# EAGLE board esp-n64 (EAGLE 9.6.2)
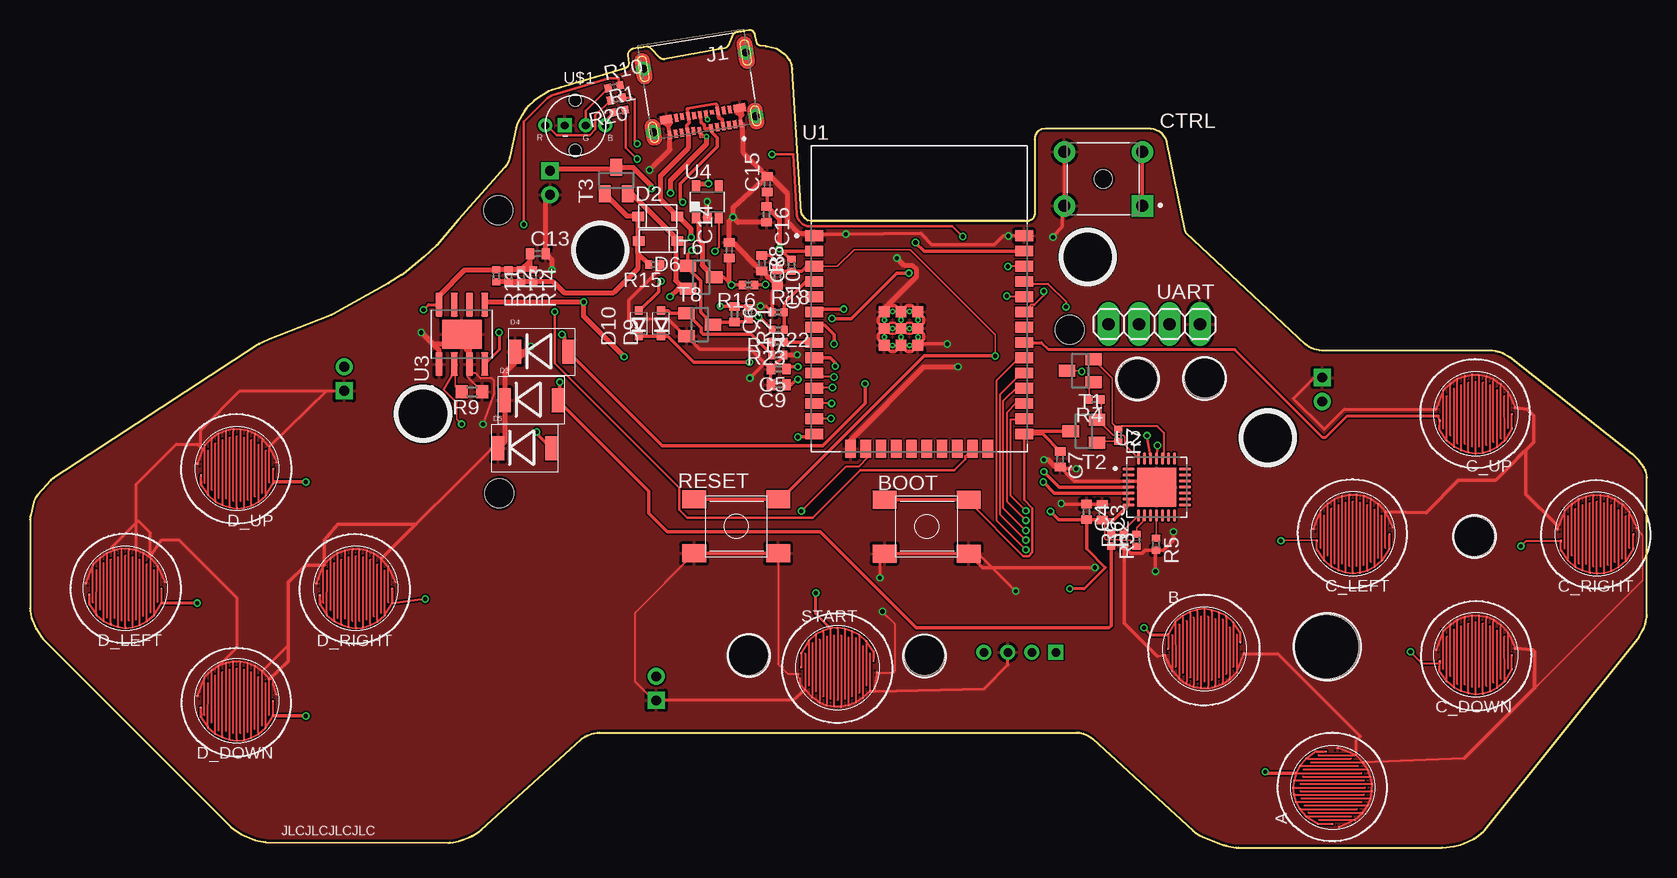
[diagram p2: board, top side]
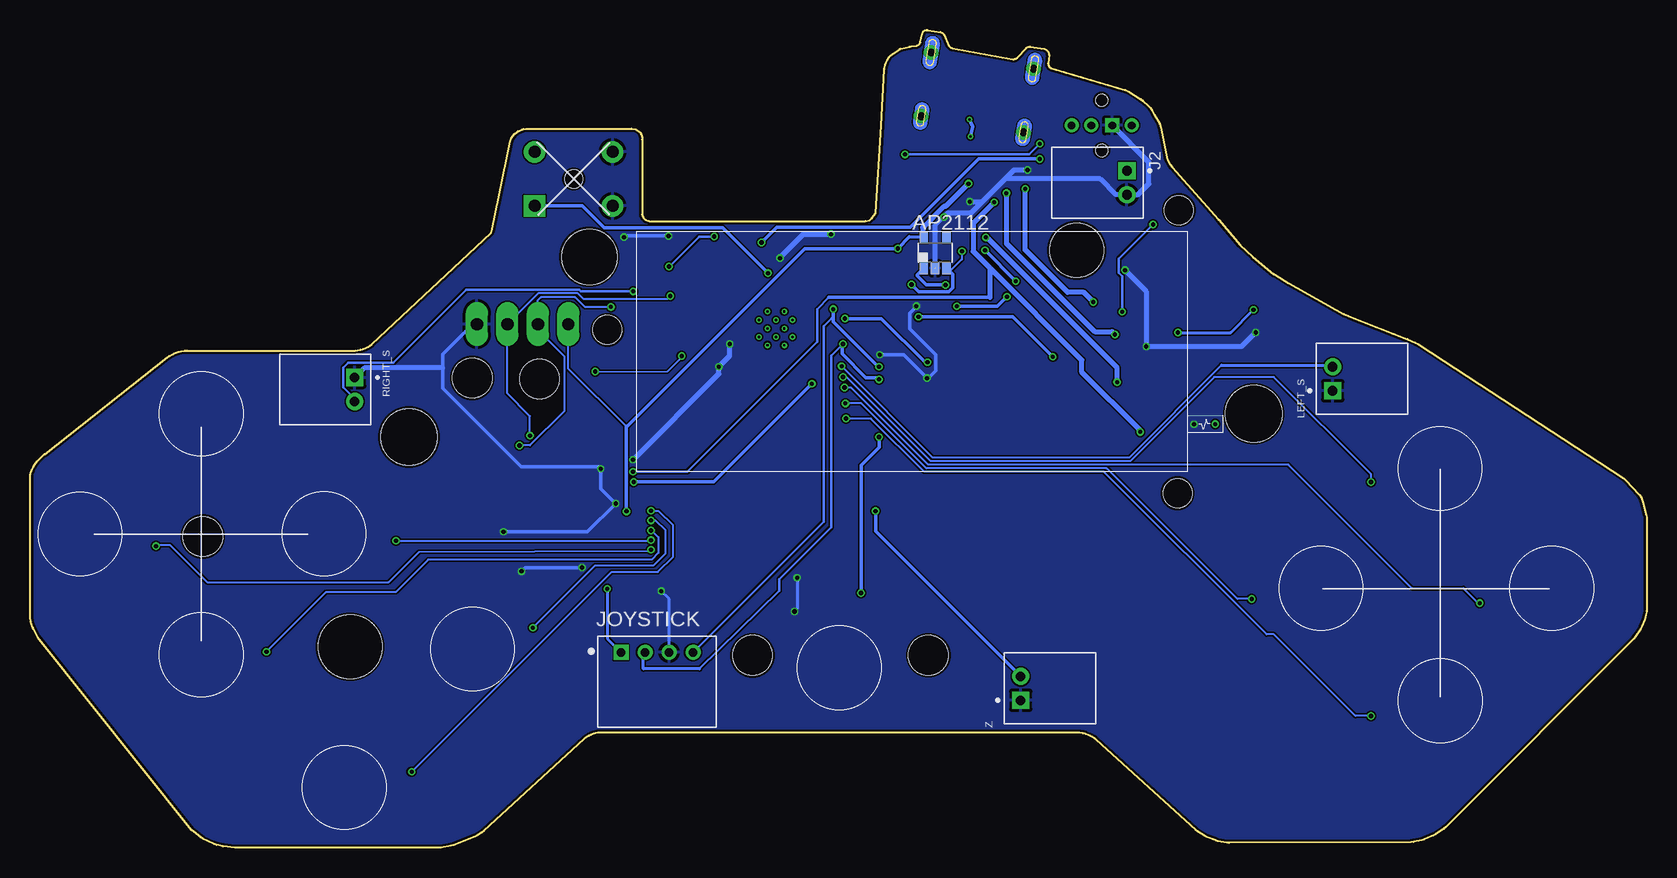
[diagram p3: board, bottom side, seen from below]

Size 134.75 x 68.14 mm. Coordinates in mm from the lower left corner, seen from the top.
Outline: 41.04,61.08 40.61,60.32 40.51,60.03 40,57.54 39.96,57.4 39.88,57.19 39.74,56.93 39.57,56.71 35.7,52.33 33.88,50.21 32.86,49.25 31.09,47.81 30.99,47.74 29.87,47.03 25.25,44.47 25.11,44.4 24.87,44.29 19.96,42.39 19.33,42.1 19.12,41.98 18.99,41.92 1.94,30.78 1.75,30.62 0.64,29.41 0.49,29.2 0.42,29.07 0.33,28.84 0.05,27.71 0.02,27.56 0,27.37 0,19.92 0.02,19.72 0.12,19.19 0.18,19 0.42,18.42 0.52,18.24 0.96,17.58 1.08,17.43 16.77,1.69 16.92,1.57 17.6,1.11 17.77,1.02 18.56,0.69 18.75,0.63 19.45,0.49 19.65,0.47 34.83,0.41 35.02,0.42 35.75,0.56 35.93,0.61 36.64,0.88 36.81,0.96 37.47,1.37 37.62,1.48 45.88,8.99 46.03,9.11 46.26,9.25 46.43,9.33 46.81,9.48 46.98,9.53 47.28,9.58 47.46,9.6 87.24,9.6 87.42,9.58 87.6,9.55 87.78,9.5 88.01,9.41 88.18,9.33 88.42,9.18 88.57,9.06 96.92,1.4 97.07,1.29 97.51,1.01 97.68,0.93 99.48,0.23 99.66,0.18 100.5,0.02 100.69,0 117.67,0 118.66,0.11 119.21,0.24 119.42,0.31 120.35,0.75 120.54,0.87 121.09,1.31 121.25,1.47 133.99,17.39 134.08,17.53 134.45,18.19 134.52,18.34 134.62,18.65 134.66,18.81 134.73,19.21 134.75,19.38 134.75,30.87 134.72,31.09 134.68,31.25 134.61,31.47 134.49,31.72 134.36,31.91 134.12,32.21 134.05,32.3 133.61,32.73 133.53,32.8 123.29,40.87 123.15,40.96 122.87,41.12 122.72,41.19 122.33,41.32 122.17,41.36 121.82,41.42 121.66,41.43 107.63,41.43 107.45,41.45 107.19,41.5 107.01,41.55 106.74,41.66 106.57,41.75 106.43,41.84 106.28,41.95 96.35,51.23 96.27,51.36 94.74,58.86 94.63,59.13 94.36,59.48 94.18,59.63 94.06,59.71 93.75,59.85 93.64,59.88 93.4,59.91 84.61,59.93 84.26,59.86 84,59.7 83.88,59.59 83.81,59.44 83.73,59.21 83.73,59.01 83.73,52.77 83.71,52.67 83.66,52.56 83.61,52.48 83.48,52.35 83.39,52.29 83.24,52.23 83.15,52.21 65.13,52.21 64.78,52.29 64.59,52.46 64.38,52.71 64.3,52.83 64.28,52.91 63.83,60.16 63.54,64.88 63.48,65.24 63.43,65.39 63.31,65.63 63.12,65.9 63,66.02 62.87,66.13 62.28,66.55 62.19,66.59 61.45,66.77 61.33,66.79 60.84,66.84 60.7,66.91 60.6,66.99 60.56,67.11 60.4,67.82 60.37,67.91 60.29,68.03 60.21,68.08 60.12,68.12 60.03,68.14 59.93,68.14 58.85,67.96 58.74,67.91 58.65,67.84 58.57,67.74 58.19,66.85 58.11,66.75 58.02,66.68 57.91,66.63 52.83,65.7 52.71,65.71 52.6,65.75 52.49,65.82 51.73,66.64 51.65,66.69 51.55,66.75 51.39,66.77 50.21,66.56 50.12,66.53 50.05,66.49 49.98,66.43 49.91,66.34 49.86,66.25 49.83,66.16 49.82,66.06 49.91,65.36 49.87,65.19 49.8,65.07 49.66,64.96 43.45,63.13 43.21,63.02 42.18,62.38 42.02,62.26 41.52,61.8 41.41,61.68 41.31,61.55 41.22,61.42 41.04,61.08
Copper layers (1*16): Top 0.035mm / dielectric 1.6mm / Bottom 0.035mm
Design rules "jlcpcb-2layers-edited": minimum track width 5mil, minimum drill 0.2mm, track to track 5mil, track to pad 5mil, pad to pad 5mil, via to via 5mil, smd to smd 5mil, copper to edge 0.2mm, drill to drill 6mil, minimum pad ring 0.13mm, minimum via ring 0.13mm, stop-mask expansion 4mil, vias tented up to drill 0mil, thermal gap 10mil
Holes 4.7 mm at 32.76,36.16 103.17,34.23
Holes 4.5 mm at 47.51,49.78
Holes 4.6 mm at 88.13,49.24
Holes 3.3 mm at 92.3,39.07 97.89,39.15 120.35,25.94 74.54,16.03 59.88,16.04
Holes 5.3 mm at 108.07,16.75
Holes 1.5 mm at 89.44,55.73
Holes 2.4 mm at 39.01,53.13 39.12,29.54 86.63,43.15
vRestrict: area 2.9,7.1 to 32.3,36.5; area 38.2,31.4 to 84.2,51.4; 1 lines

## Footprints (pad centres in the part's own frame; a part is rotated, then mirrored left to right if it is on the bottom)
BUTTON-PAD = smd 0.15 x 0.15: DATA 3,0.56; DATA2 2.41,2.22; DATA3 1.8,2.75; DATA4 1.2,3.05; DATA5 0.6,3.23; DATA6 0,3.33; DATA7 -0.6,3.27; DATA8 -1.2,3.09; DATA9 -1.8,2.77; DATA10 -2.41,2.25; DATA11 -3.03,1.23; DATA12 -3.03,0.01; G2 2.7,-1.95; G3 2.1,-2.51; G4 1.52,-2.91; G5 0.9,-3.14; G6 0.3,-3.27; G7 -0.3,-3.25; G8 -0.91,-3.15; G9 -1.5,-2.9; G10 -2.11,-2.48; G11 -2.7,-1.82; G12 -3.3,-0.52; GND 3.3,-0.4
SOT-23-5 = smd 0.69 x 0.99: 1 -0.95,-1.29; 2 0,-1.29; 3 0.95,-1.29; 4 0.95,1.3; 5 -0.95,1.3
TS1187 = smd 2 x 1.5: A -3.5,2.25; B 3.5,2.25; C -3.5,-2.25; D 3.5,-2.25
C0402 = smd 0.7 x 0.9: 1 -0.65,0; 2 0.65,0
SW_FSM14J = drill 1 square: 1 -3.25,2.25 | drill 1: 2 -3.25,-2.25; 3 3.25,2.25; 4 3.25,-2.25
SOD-123 = smd 1 x 0.8: A 1.62,0; C -1.62,0
P6SMB6 = smd 1 x 2: 1 -2.21,0; 2 2.21,0
SOD323 = smd 0.7 x 0.7: A 1.075,0; C -1.075,0
MOLEX_105450-0101-SIMPLE = smd 0.3 x 0.7: A1 -3,3.77; A2 -2.5,3.77; A3 -2,3.77; A4 -1.5,3.77; A5 -1,3.77; A6 -0.5,3.77; A8 1,3.77; A9 1.5,3.77; A10 2,3.77; A11 2.5,3.77; A12 3,3.77; B2 2.25,2.47; B4 1.25,2.47; B9 -1.25,2.47; B10 -1.75,2.47; B11 -2.25,2.47 | smd 0.3 x 0.6: A7 0.5,3.82; B3 1.75,2.42; B5 0.75,2.52; B6 0.25,2.52; B7 -0.25,2.52 | smd 1 x 0.7: B1 3.1,2.47; B12 -3.1,2.47 | smd 0.3 x 0.4: B8 -0.75,2.47 | drill 0.2 pad 0.4: P$1 0,4.4; P$2 -0.3,3 | drill 0.65 pad 1.2: S1 -4.32,3.36; S2 4.32,3.36; S3 -4.32,-2; S4 4.32,-2
JST_S2B-PH-K-S(LF)(SN) = drill 0.8 square: 1 -1,0 | drill 0.8: 2 1,0
JST_S4B-PH-K-S(LF)(SN) = drill 0.7 square: 1 -3,0 | drill 0.7: 2 -1,0; 3 1,0; 4 3,0
R0402 = smd 0.6 x 0.7: 1 -0.5,0; 2 0.5,0
R0603 = smd 1 x 1.1: 1 -0.85,0; 2 0.85,0
SOT23 = smd 1.4 x 1: 1 -1.1,0.95; 2 -1.1,-0.95; 3 1.1,0
ESP32-WROOM-32E = smd 1.5 x 0.9: 1 -8.75,5.26; 2 -8.75,3.99; 3 -8.75,2.72; 4 -8.75,1.45; 5 -8.75,0.18; 6 -8.75,-1.09; 7 -8.75,-2.36; 8 -8.75,-3.63; 9 -8.75,-4.9; 10 -8.75,-6.17; 11 -8.75,-7.44; 12 -8.75,-8.71; 13 -8.75,-9.98; 14 -8.75,-11.25; 25 8.75,-11.25; 26 8.75,-9.98; 27 8.75,-8.71; 28 8.75,-7.44; 29 8.75,-6.17; 30 8.75,-4.9; 31 8.75,-3.63; 32 8.75,-2.36; 33 8.75,-1.09; 34 8.75,0.18; 35 8.75,1.45; 36 8.75,2.72; 37 8.75,3.99; 38 8.75,5.26 | smd 0.9 x 1.5: 15 -5.715,-12.5; 16 -4.445,-12.5; 17 -3.175,-12.5; 18 -1.905,-12.5; 19 -0.635,-12.5; 20 0.635,-12.5; 21 1.905,-12.5; 22 3.175,-12.5; 23 4.445,-12.5; 24 5.715,-12.5 | smd 0.9 x 0.9: 39_1 -2.9,-1.06; 39_2 -1.5,-1.06; 39_3 -0.1,-1.06; 39_4 -2.9,-2.46; 39_5 -1.5,-2.46; 39_6 -0.1,-2.46; 39_7 -2.9,-3.86; 39_8 -1.5,-3.86; 39_9 -0.1,-3.86 | drill 0.2 pad 0.3: 39_10 -2.2,-1.06; 39_11 -0.8,-1.06; 39_12 -2.9,-1.76; 39_13 -1.5,-1.76; 39_14 -0.1,-1.76; 39_15 -2.2,-2.46; 39_16 -0.8,-2.46; 39_17 -2.9,-3.16; 39_18 -1.5,-3.16; 39_19 -0.1,-3.16; 39_20 -2.2,-3.86; 39_21 -0.8,-3.86
QFN50P500X500X80-29N = smd 1.01 x 0.27: 1 -2.36,1.5; 2 -2.36,1; 3 -2.36,0.5; 4 -2.36,0; 5 -2.36,-0.5; 6 -2.36,-1; 7 -2.36,-1.5; 15 2.36,-1.5; 16 2.36,-1; 17 2.36,-0.5; 18 2.36,0; 19 2.36,0.5; 20 2.36,1; 21 2.36,1.5 | smd 0.27 x 1.01: 8 -1.5,-2.36; 9 -1,-2.36; 10 -0.5,-2.36; 11 0,-2.36; 12 0.5,-2.36; 13 1,-2.36; 14 1.5,-2.36; 22 1.5,2.36; 23 1,2.36; 24 0.5,2.36; 25 0,2.36; 26 -0.5,2.36; 27 -1,2.36; 28 -1.5,2.36 | smd 3.25 x 3.25: 29 0,0
SOP127P600X175-9N = smd 1.97 x 0.6: 1 -2.475,1.905; 2 -2.475,0.635; 3 -2.475,-0.635; 4 -2.475,-1.905; 5 2.475,-1.905; 6 2.475,-0.635; 7 2.475,0.635; 8 2.475,1.905 | smd 2.413 x 3.302: 9 0,0
1X04-LED-RGB = drill 0.65 square: GND -0.87,-0.01 | drill 0.65: VB 2.51,-0.01; VG 0.87,-0.01; VR -2.51,-0.01 | hole 1: 0,2.1; 0,-2.1
1X04 = drill 1.016 long: 1 -3.81,0; 2 -1.27,0; 3 1.27,0; 4 3.81,0

## Placement (x,y rotation side)
A  BUTTONPCB-CONDUCTIVE  [BUTTON-PAD]  108.57,5.02 90 top
AP2112  AP2112K  [SOT-23-5]  59.32,49.59 0 bottom
B  BUTTONPCB-CONDUCTIVE  [BUTTON-PAD]  97.87,16.57 0 top
BOOT  TS1187-SIMPLE  [TS1187]  74.72,26.77 180 top
C3  C_4.7UF/10V_0402  [C0402]  89.36,27.98 270 top
C4  C_100NF/16V_0402  [C0402]  88.05,27.99 270 top
C5  C_100NF/16V_0402  [C0402]  62.39,39.89 180 top
C6  10NF/50V  [C0402]  58.71,44.45 270 top
C7  C_100NF/16V_0402  [C0402]  85.85,32.37 270 top
C8  C_100NF/16V_0402  [C0402]  60.99,48.7 270 top
C9  C_100NF/16V_0402  [C0402]  62.39,38.57 180 top
C10  C_100NF/16V_0402  [C0402]  62.29,47.51 270 top
C13  C_1UF/25V_0402  [C0402]  42.33,49.51 0 top
C14  C_10UF/6.3V_0402  [C0402]  58.27,49.79 90 top
C15  C_10UF/6.3V_0402  [C0402]  61.44,55.29 90 top
C16  C_1UF/25V_0402  [C0402]  61.38,52.77 270 top
C_DOWN  BUTTONPCB-CONDUCTIVE  [BUTTON-PAD]  120.47,16.09 180 top
C_LEFT  BUTTONPCB-CONDUCTIVE  [BUTTON-PAD]  110.24,26.17 180 top
C_RIGHT  BUTTONPCB-CONDUCTIVE  [BUTTON-PAD]  130.58,26.14 180 top
C_UP  BUTTONPCB-CONDUCTIVE  [BUTTON-PAD]  120.47,36.15 180 top
CTRL  FSM14J-SIMPLE  [SW_FSM14J]  89.45,55.74 180 top
D2  B5819W  [SOD-123]  52.31,52.61 0 top
D3  P6SMB6-JLC  [P6SMB6]  41.77,37.29 0 top
D4  P6SMB6-JLC  [P6SMB6]  42.65,41.32 0 top
D5  P6SMB6-JLC  [P6SMB6]  41.22,33.28 0 top
D6  B5819W  [SOD-123]  52.34,50.55 180 top
D9  1N5819WS  [SOD323]  52.58,43.7 90 top
D10  1N5819WS  [SOD323]  50.73,43.7 90 top
D_DOWN  BUTTONPCB-CONDUCTIVE  [BUTTON-PAD]  17.23,12.24 180 top
D_LEFT  BUTTONPCB-CONDUCTIVE  [BUTTON-PAD]  7.94,21.63 180 top
D_RIGHT  BUTTONPCB-CONDUCTIVE  [BUTTON-PAD]  27.16,21.61 180 top
D_UP  D_UP  [BUTTON-PAD]  17.25,31.6 180 top
J1  105450-0101-JLC-SIMPLE  [MOLEX_105450-0101-SIMPLE]  55.69,63.61 189 top
J2  S2B-PH-K-S(LF)(SN)  [JST_S2B-PH-K-S(LF)(SN)]  43.34,55.42 270 bottom
JOYSTICK  S4B-PH-K-S(LF)(SN)  [JST_S4B-PH-K-S(LF)(SN)]  82.49,16.28 0 bottom
LEFT_S  S2B-PH-K-S(LF)(SN)  [JST_S2B-PH-K-S(LF)(SN)]  26.19,39.08 90 bottom
R1  R_470R_0402  [R0402]  49.1,61.38 12 top
R2  R_4.7K_0402  [R0402]  92.21,25.62 90 top
R3  R_24K_0402  [R0402]  90.11,25.64 270 top
R4  R_10K_0402  [R0402]  88.76,37.35 180 top
R5  R_10K_0402  [R0402]  93.84,25.29 270 top
R6  R_47K_0402  [R0402]  91.16,25.62 90 top
R7  R_10K_0402  [R0402]  90.68,34.38 270 top
R8  R_10K_0402  [R0402]  63.45,48.53 90 top
R9  R_1.1K_0603  [R0603]  36.83,37.99 180 top
R10  R_470R_0402  [R0402]  48.68,63.41 12 top
R11  R_1R_0402  [R0402]  38.85,47.66 270 top
R12  R_1R_0402  [R0402]  39.88,47.66 270 top
R13  R_1R_0402  [R0402]  40.91,47.66 270 top
R14  R_1R_0402  [R0402]  41.94,47.66 270 top
R15  R_100K_0402  [R0402]  52.05,48.61 180 top
R16  R_100K_0402  [R0402]  59.87,46.9 180 top
R17  R_100K_0402  [R0402]  62.36,43.16 180 top
R18  R_100K_0402  [R0402]  62.34,44.62 0 top
R20  R_470R_0402  [R0402]  48.88,62.39 192 top
R21  100K  [R0402]  59.88,44.5 270 top
R22  R_1M_0402  [R0402]  62.32,41.08 0 top
R23  R_330R_0402  [R0402]  62.35,42.13 180 top
RESET  TS1187-SIMPLE  [TS1187]  58.85,26.77 180 top
RIGHT_S  S2B-PH-K-S(LF)(SN)  [JST_S2B-PH-K-S(LF)(SN)]  107.69,38.18 270 bottom
START  BUTTONPCB-CONDUCTIVE  [BUTTON-PAD]  67.3,15 0 top
T1  T_NPN_SS8050_CHANGJ_SOT23-BEC  [SOT23]  87.52,39.75 180 top
T2  T_NPN_SS8050_CHANGJ_SOT23-BEC  [SOT23]  87.82,34.71 180 top
T3  PMOS_AO3401A  [SOT23]  48.85,55.6 90 top
T6  PMOS_AO3401A  [SOT23]  55.93,47.53 0 top
T8  NMOS-2N7002  [SOT23]  55.81,43.59 0 top
U1  ESP32-WROOM-32E_4MB  [ESP32-WROOM-32E]  74.09,45.73 0 top
U2  CP2102-JLC  [QFN50P500X500X80-29N]  93.89,30.06 0 top
U3  TP4056  [SOP127P600X175-9N]  35.99,42.78 90 top
U4  AP2112K-JLC  [SOT-23-5]  56.45,53.81 0 top
U$1  RGB-LED  [1X04-LED-RGB]  45.44,60.2 0 top
UART  [1X04]  93.69,43.63 0 top
Z  S2B-PH-K-S(LF)(SN)  [JST_S2B-PH-K-S(LF)(SN)]  52.19,13.28 90 bottom

## Tracks (layer width: path | path; a pad name or v marks a point on that pad's centre or on a via)
+5V
  Top 0.152: D2.C 50.45,52.63
  Top 0.305: 39.94,47.04 40.99,47.04 | 40.87,47.16 R14.2
  Top 0.406: R11.2 39.82,47.16 39.94,47.04 | R12.2 40.87,47.16 40.99,47.04 | R13.2 R14.2 43.61,47.16 44.52,46.25 48.64,46.25 50.63,48.23 50.63,50.47 D6.A | D6.A 50.62,50.45 50.62,49.54 R15.2 | T3.1 49.77,52.63 50.45,52.63 | D6.A 50.69,50.58 D2.C
DTR
  Top 0.127: U2.28 91.22,33.58 91.22,34.26 91.09,34.39 90.25,34.39 88.98,35.66 T2.2 89.26,36 R4.1
EN  (via drill 0.35)
  Top 0.127: T1.3 87.57,39.75 v87.64,39.68 | v80.44,40.98 80.44,42.73 73.34,49.83 68.67,49.83 67.29,48.45 U1.3
  Top 0.305: U1.3 65.26,48.53 64.79,48.53 64.3,48.03 R8.1 62.41,48.03 C10.1 62.47,48.34 62.47,48.57 61.69,49.36 C8.1 | RESET.D RESET.C 62.55,29.02 66.88,33.36 66.89,33.36 74.51,40.98 v80.44,40.98
  Bottom 0.127: v87.64,39.68 81.64,39.68 80.44,40.88 v80.44,40.98
GND  (via drill 0.35)
  Top 0.127: R5.2 92.8,24.79 92.64,24.63 91.65,24.63 91.2,25.09 R6.1 | C_RIGHT.G12 134.41,26.02 134.41,22.3 125.39,13.28 | R9.1 36.43,39.24 36.52,39.52 36.59,39.76 36.59,41.04 | 53.35,59.26 53.32,59.4 J1.A12 J1.B1 | U3.1 34.09,40.28 | D_DOWN.G11 20.21,14.01
  Top 0.152: 123.34,31.83 124.57,33.06 124.67,33.16 | 124.67,33.16 125.32,33.81 | 124.67,33.16 124.67,32.98 | 91.2,24.98 91.2,25.09 | RESET.A 62.35,15.29 63.17,14.47 63.99,14.47 START.G12 64,14.24 64.15,14.09 64.15,13.63 START.G11 START.G10 START.G9 START.G8 START.G7 START.G6 START.G5 START.G4 START.G3 START.G2 | START.GND 71.92,14.6 72.05,14.73 72.05,18.68 v71.04,19.68 | 125.39,14.63 125.37,14.61 | v37.75,35.29 38.7,37.84 38.67,38.93 38.48,39.12 37.56,39.12 37.15,39.52 36.52,39.52 | D_DOWN.G12 20.3,13.51 20.21,13.6 20.21,14.01 | D_DOWN.G11 D_DOWN.G10 D_DOWN.G9 D_DOWN.G8 D_DOWN.G7 D_DOWN.G6 D_DOWN.G5 D_DOWN.G4 D_DOWN.G3 D_DOWN.G2 D_DOWN.GND | D_LEFT.G5 D_LEFT.G6 D_LEFT.G7 D_LEFT.G8 D_LEFT.G9 D_LEFT.G10 D_LEFT.G11 D_LEFT.G12 | D_LEFT.G5 6.78,25 | D_LEFT.G5 D_LEFT.G4 D_LEFT.G3 D_LEFT.G2 D_LEFT.GND | D_RIGHT.G12 D_RIGHT.G11 D_RIGHT.G10 D_RIGHT.G9 D_RIGHT.G8 D_RIGHT.G7 D_RIGHT.G6 D_RIGHT.G5 D_RIGHT.G4 D_RIGHT.G3 D_RIGHT.G2 D_RIGHT.GND | D_UP.G12 D_UP.G11 D_UP.G10 D_UP.G9 D_UP.G8 D_UP.G7 D_UP.G6 D_UP.G5 D_UP.G4 D_UP.G3 D_UP.G2 14.4,33.17 D_UP.GND | B.G11 B.G10 B.G9 B.G8 B.G7 B.G6 B.G5 B.G4 B.G3 B.G2 101.16,16.15 B.GND | A.G12 A.G11 A.G10 A.G9 A.G8 A.G7 A.G6 A.G5 A.G4 A.G3 A.G2 A.GND | C_DOWN.GND C_DOWN.G2 C_DOWN.G3 C_DOWN.G4 C_DOWN.G5 C_DOWN.G6 C_DOWN.G7 C_DOWN.G8 C_DOWN.G9 C_DOWN.G10 C_DOWN.G11 C_DOWN.G12 | C_RIGHT.GND C_RIGHT.G2 C_RIGHT.G3 C_RIGHT.G4 C_RIGHT.G5 C_RIGHT.G6 C_RIGHT.G7 C_RIGHT.G8 C_RIGHT.G9 C_RIGHT.G10 C_RIGHT.G11 C_RIGHT.G12 | C_UP.GND C_UP.G2 C_UP.G3 C_UP.G4 C_UP.G5 C_UP.G6 C_UP.G7 C_UP.G8 C_UP.G9 C_UP.G10 C_UP.G11 C_UP.G12 | C_LEFT.GND C_LEFT.G2 C_LEFT.G3 C_LEFT.G4 C_LEFT.G5 C_LEFT.G6 C_LEFT.G7 C_LEFT.G8 C_LEFT.G9 C_LEFT.G10 C_LEFT.G11 C_LEFT.G12
  Top 0.152: U2.29 93.34,30.43 | U3.3 36.66,41.21 | J1.B12 J1.A1 | Z.1 51.97,12.28 50.42,13.84 50.42,19.57 55.37,24.52
  Top 0.2: 14.4,33.17 14.22,33.36 | START.GND 70.35,13.06 | 93.92,15.97 B.G12 B.G11 | C_RIGHT.GND 127.17,26.96 | A.G3 119.53,7.47
  Top 0.203: 73.94,43.27 73.48,43.73 73.1,43.73 72.64,43.27 U1.39_5 72.54,43.27 | 72.54,43.27 72.43,43.17 | 72.43,43.17 72.08,42.81 71.7,42.81 71.24,43.27 | U1.39_4 71.24,43.27 | 71.24,43.27 71.7,43.73 72.08,43.73 72.54,43.27 | U1.39_6 73.94,43.27 | 73.94,43.27 73.48,42.81 73.1,42.81 72.75,43.17 72.43,43.17
  Top 0.254: RIGHT_S.1 107.01,39.18 105.26,37.43 107.84,34.85 109.54,36.55 C_UP.GND | v70.82,22.49 70.82,24.12 BOOT.B BOOT.A 79,24.52 v82.14,21.38 | D_DOWN.G4 17.25,16.68 17.25,20.83 12.43,25.64 10.94,25.64 10.02,24.26 10.02,26.23 9.01,27.24 6.78,25 | D_LEFT.G8 8.86,30.3 12.19,33.63 13.94,33.63 14.22,33.36 14.22,34.8 17.49,38.08 25.1,38.08 LEFT_S.1 24.73,38.08 D_UP.G11 | D_DOWN.G10 21.54,16.89 21.54,20.83 | D_RIGHT.G10 38.43,33.22 38.95,33.22 | START.G11 64.46,13.06 63.58,12.28 Z.1 | START.G2 70.35,13.06 79.5,13.24 81.49,15.23 JOYSTICK.3 | C9.2 C5.2 | B.GND 103.98,16.17 110.86,9.28 110.52,8.94 A.G2
  Top 0.305: C10.2 61.84,46.41 61.84,44.99 | 61.84,44.99 R18.1 61.35,45.11 60.9,45.11 v60.88,45.13 | 61.84,44.99 | CTRL.4 CTRL.3 86.04,53.33 86.04,51.76 85.25,50.97 v85.25,50.88 | C5.2 61.24,40.38 v59.99,39.13 | R22.2 62.82,40.97 C5.2 | C5.2 60.08,41.55 55.81,41.55 T8.2 54.66,42.58 53.16,44.08 49.89,44.03 49.89,45.61 52.55,48.27 R15.1 | RESET.B 55.37,24.52 RESET.A | C3.1 89.34,28.64 C4.1 85.98,28.64 v85.94,28.68 | v87.19,31.58 85.98,31.58 C7.2 87.01,30.56 U2.3 93.21,30.56 93.34,30.43 | U1.38 v81.53,50.98 81.09,50.98 80.37,50.26 75.17,50.26 74.22,51.2 v68,51.12 v67.99,51.13 v67.98,51.12 65.47,51.12 U1.1 | C_UP.G12 124.77,36.55 125.32,36.01 125.32,33.81 124.57,33.06 | 127.17,26.96 124.67,29.46 124.67,32.98 124.49,32.98 123.34,31.83 122.14,30.63 119.04,30.63 116.34,27.94 C_LEFT.G11 | C_DOWN.G12 125.22,16.49 125.39,16.32 125.39,14.63 125.39,13.28 | 125.37,14.61 125.37,13.31 119.53,7.47 | 93.92,15.97 91.2,18.69 91.2,24.98 | R5.2 92.93,24.79 92.68,24.54 91.74,24.54 R6.1 | R5.2 | BOOT.A 79.38,23.35 v88.74,23.35 | v93.79,23.03 93.79,24.74 R5.2 | D_DOWN.G11 21.54,15.54 21.54,20.83 21.54,22.13 22.96,23.55 24.51,23.55 24.51,25.6 25.65,26.95 32.15,26.95 D_RIGHT.G10 | v95.29,26.33 95.29,25.63 94.44,24.78 93.85,24.78 R5.2 | 38.95,33.22 D5.1 | U1.39_9 73.8,41.68 73.8,41.66 73.5,41.36 73.08,41.36 72.78,41.66 72.78,41.68 U1.39_8 72.4,41.68 72.4,41.66 72.1,41.36 71.68,41.36 71.38,41.66 71.38,41.68 U1.39_7 71,42.06 70.98,42.06 70.68,42.36 70.68,42.78 70.98,43.08 71,43.08 U1.39_4 71,43.46 70.98,43.46 70.68,43.76 70.68,44.18 70.98,44.48 71,44.48 U1.39_1 71.38,44.86 71.38,44.88 71.68,45.18 72.1,45.18 72.4,44.88 72.4,44.86 U1.39_2 72.78,44.86 72.78,44.88 73.08,45.18 73.5,45.18 73.8,44.88 73.8,44.86 U1.39_3 74.18,44.48 74.2,44.48 74.5,44.18 74.5,43.76 74.2,43.46 74.18,43.46 U1.39_6 74.18,43.08 74.2,43.08 74.5,42.78 74.5,42.36 74.2,42.06 74.18,42.06 U1.39_9
  Top 0.305: v76.44,41.98 74.1,41.98 U1.39_9
  Top 0.406: v43.49,48.13 43.49,49 C13.2 42.98,54.06 J2.2 | D4.1 41.28,41.32 v41.73,41.77 39.56,39.6 D3.1 39.56,33.83 D5.1 | 34.09,40.28 34.09,41.45 v32.6,42.94 33.59,41.95 35.92,41.95 36.66,41.21 | 36.59,41.04 36.58,41.04 36.63,41 U3.3 36.63,42.15 U3.9 | C7.2 85.47,31.72 84.85,32.33 v84.49,32.33 | U1.15 68.38,33.97 74.49,40.08 v77.34,40.08 | U1.39_1 71.19,44.93 73.88,47.62 73.88,48.14 73.5,48.52 72.86,48.52 v72.24,49.13 | U1.1 65.15,51.18 64.11,51.18 63.14,52.15 63.14,54.49 61.69,55.94 C15.2 | R22.2 v63.94,41.08 | C10.2 62.26,46.86 61.55,47.57 61.48,47.57 C8.2 60.95,48.05 58.57,50.44 C14.2 58.27,52.23 v58.59,52.55 | v58.59,52.55 58.59,52.53 59.01,52.12 C16.2 | v51.62,56.48 53.32,58.18 53.32,59.23 53.35,59.26 | v58.59,52.55 58.59,53.36 C15.2 | U4.2 56.45,53.82 v56.43,53.84 | J1.A1 59.35,60.26 59.4,57.97 C15.2
  Bottom 0.152: 68.04,51.13 v67.99,51.13
  Bottom 0.254: v71.04,19.68 70.82,19.9 v70.82,22.49 | JOYSTICK.3 81.49,20.73 v82.14,21.38
  Bottom 0.305: 59.32,51.82 v58.59,52.55 | v85.25,50.88 85.15,50.98 v81.53,50.98 | UART.4 97.87,43.63 100.36,41.13 100.36,39.98 100.36,38.31 93.79,31.73 87.34,31.73 v87.19,31.58 87.19,29.93 v85.94,28.68 88.29,26.33 v95.29,26.33 | v60.88,45.13 60.88,45.07 61.42,44.52 61.42,43.23 59.26,41.07 59.26,39.76 59.89,39.13 v59.99,39.13 61.94,41.08 v63.94,41.08 | v93.79,23.03 93.47,23.35 v88.74,23.35
  Bottom 0.406: v43.49,48.13 41.73,46.37 v41.73,41.77 33.77,41.77 v32.6,42.94 | 100.36,39.98 106.89,39.98 RIGHT_S.1 | v84.49,32.33 77.34,39.48 v77.34,40.08 76.44,40.98 v76.44,41.98 | 68.04,51.13 70.3,51.13 72.24,49.19 v72.24,49.13 | v58.59,52.55 58.23,52.91 56.31,52.91 55.4,53.82 | AP2112.2 59.32,51.82 | 55.4,53.82 53.49,55.73 | 53.49,55.73 45.56,55.73 44.25,54.42 J2.2 42.42,54.42 41.51,55.33 41.51,57.13 U$1.GND | 53.49,55.73 52.74,56.48 v51.62,56.48 | v56.43,53.84 56.41,53.82 55.4,53.82
  pour Bottom (isolate 0.016): 0.1,27.55 0.46,28.96 0.66,29.26 1.94,30.64 15.96,39.79 19.39,42.03 25.03,44.26 26.46,45.05 30.24,47.13 31.07,47.68 32.59,48.9 33.95,50.15 36.09,52.65 39.83,56.89 40.09,57.58 40.6,60.07 40.79,60.5 41.49,61.68 42.11,62.24 43.34,62.99 45.67,63.71 49.68,64.9 49.87,65.04 49.98,65.27 49.99,65.52 49.92,66.1 49.99,66.31 50.11,66.42 50.35,66.5 51.38,66.66 51.57,66.63 51.7,66.54 51.87,66.3 52.36,65.79 52.71,65.61 53.16,65.65 57.96,66.54 58.22,66.68 58.31,66.86 58.74,67.8 58.84,67.86 60.05,68.03 60.19,67.97 60.29,67.87 60.47,67.01 60.54,66.91 60.66,66.83 60.81,66.75 61,66.72 61.35,66.67 61.68,66.62 62.12,66.53 62.35,66.4 62.61,66.18 62.96,65.94 63.17,65.71 63.32,65.43 63.43,65.11 63.47,64.83 63.47,64.65 64.2,52.9 64.25,52.69 64.36,52.55 64.57,52.35 64.78,52.21 65.09,52.13 65.27,52.14 83.14,52.14 83.38,52.18 83.54,52.29 83.69,52.46 83.8,52.69 83.81,52.85 83.82,59.16 83.88,59.37 83.96,59.53 84.16,59.7 84.33,59.78 84.57,59.85 85.72,59.85 93.57,59.81 93.86,59.71 94.12,59.57 94.31,59.42 94.4,59.29 94.59,59.02 94.67,58.83 94.73,58.57 96.17,51.42 96.28,51.21 96.39,51.05 96.57,50.88 106.28,41.82 106.49,41.68 106.79,41.54 107.11,41.44 107.42,41.36 107.71,41.34 121.78,41.34 122.07,41.3 122.35,41.21 122.62,41.12 122.87,41.02 123.12,40.89 123.41,40.7 123.67,40.48 133.65,32.61 133.88,32.37 134.12,32.09 134.44,31.62 134.56,31.33 134.63,31.09 134.67,30.87 134.66,30.69 134.66,19.29 134.58,18.81 134.46,18.45 134.28,18.06 134.02,17.57 133.76,17.23 121.23,1.58 120.95,1.3 120.48,0.93 119.36,0.36 118.6,0.18 117.65,0.06 100.59,0.1 99.5,0.31 97.63,1.04 97.01,1.41 96.45,1.94 88.57,9.21 88.26,9.41 87.82,9.6 87.46,9.68 47.32,9.7 46.82,9.6 46.38,9.42 46.03,9.2 45.73,8.98 37.51,1.5 37.11,1.27 36.6,0.97 35.88,0.68 35.04,0.52 33.83,0.51 19.52,0.57 18.63,0.78 17.81,1.12 16.96,1.66 16.54,2.05 8.65,9.99 8.17,10.5 5.76,12.88 1.1,17.57 0.64,18.25 0.23,19.12 0.11,19.9 0.1,20.36 0.1,27.37
  pour Top (isolate 0.016): 0.18,27.58 0.54,28.99 0.74,29.29 2.02,30.67 16.04,39.82 19.47,42.06 25.11,44.29 26.54,45.08 30.32,47.16 31.15,47.71 32.67,48.93 34.03,50.18 36.17,52.68 39.91,56.92 40.17,57.61 40.68,60.1 40.87,60.53 41.57,61.71 42.19,62.27 43.42,63.02 45.75,63.74 49.76,64.93 49.95,65.07 50.06,65.3 50.07,65.55 50,66.13 50.07,66.34 50.19,66.45 50.43,66.53 51.46,66.69 51.65,66.66 51.78,66.57 51.95,66.33 52.44,65.82 52.79,65.64 53.24,65.68 58.04,66.57 58.3,66.71 58.39,66.89 58.82,67.83 58.92,67.89 60.13,68.06 60.27,68 60.37,67.9 60.55,67.04 60.62,66.94 60.74,66.86 60.89,66.78 61.08,66.75 61.43,66.7 61.76,66.65 62.2,66.56 62.43,66.43 62.69,66.21 63.04,65.97 63.25,65.74 63.4,65.46 63.51,65.14 63.55,64.86 63.55,64.68 64.28,52.93 64.33,52.72 64.44,52.58 64.65,52.38 64.86,52.24 65.17,52.16 65.35,52.17 83.22,52.17 83.46,52.21 83.62,52.32 83.77,52.49 83.88,52.72 83.89,52.88 83.9,59.19 83.96,59.4 84.04,59.56 84.24,59.73 84.41,59.81 84.65,59.88 85.8,59.88 93.65,59.84 93.94,59.74 94.2,59.6 94.39,59.45 94.48,59.32 94.67,59.05 94.75,58.86 94.81,58.6 96.25,51.45 96.36,51.24 96.47,51.08 96.65,50.91 106.36,41.85 106.57,41.71 106.87,41.57 107.19,41.47 107.5,41.39 107.79,41.37 121.86,41.37 122.15,41.33 122.43,41.24 122.7,41.15 122.95,41.05 123.2,40.92 123.49,40.73 123.75,40.51 133.73,32.64 133.96,32.4 134.2,32.12 134.52,31.65 134.64,31.36 134.71,31.12 134.75,30.9 134.74,30.72 134.74,19.32 134.66,18.84 134.54,18.48 134.36,18.09 134.1,17.6 133.84,17.26 121.31,1.61 121.03,1.33 120.56,0.96 119.44,0.39 118.68,0.21 117.73,0.09 100.67,0.13 99.58,0.34 97.71,1.07 97.09,1.44 96.53,1.97 88.65,9.24 88.34,9.44 87.9,9.63 87.54,9.71 47.4,9.73 46.9,9.63 46.46,9.45 46.11,9.23 45.81,9.01 37.59,1.53 37.19,1.3 36.68,1 35.96,0.71 35.12,0.55 33.91,0.54 19.6,0.6 18.71,0.81 17.89,1.15 17.04,1.69 16.62,2.08 8.73,10.02 8.25,10.53 5.84,12.91 1.18,17.6 0.72,18.28 0.31,19.15 0.19,19.93 0.18,20.39
IO0
  Top 0.2: BOOT.C 78.22,28.85 82.77,24.3 83.21,24.3 83.52,24.61 83.52,28.3 82.84,28.98 U1.25
  Top 0.305: T2.3 83.07,34.71 U1.25 84.38,34.48 C7.1 | BOOT.D BOOT.C
IO4  (via drill 0.35)
  Top 0.152: U1.26 82.76,35.67 81.7,35.67 81.7,29.37 v82.99,28.08 | A.DATA 107.19,8.02 A.DATA2 A.DATA3 A.DATA4 A.DATA5 A.DATA6 A.DATA7 A.DATA8 A.DATA9 A.DATA10 A.DATA11 A.DATA12
  Top 0.305: A.DATA4 103.04,6.23 v102.94,6.33
  Bottom 0.152: v82.99,28.08 82.37,28.08 81.15,26.86 81.15,24.26 82.41,22.99 86.28,22.99 v102.94,6.33
IO5  (via drill 0.35)
  Top 0.152: U1.29 82.81,39.59 82.66,39.59 80.82,37.76 80.82,27.8 v82.99,25.63 | v104.24,25.58 v104.25,25.58 C_LEFT.DATA 107.24,24.91 C_LEFT.DATA2 C_LEFT.DATA3 C_LEFT.DATA4 C_LEFT.DATA5 C_LEFT.DATA6 C_LEFT.DATA7 C_LEFT.DATA8 C_LEFT.DATA9 C_LEFT.DATA10 C_LEFT.DATA11 C_LEFT.DATA12
  Bottom 0.152: v104.24,25.58 83.04,25.58 v82.99,25.63
IO12  (via drill 0.35)
  Top 0.152: START.DATA 70.31,16.35 START.DATA2 START.DATA3 START.DATA4 START.DATA5 START.DATA6 START.DATA7 START.DATA8 START.DATA9 START.DATA10 START.DATA11 START.DATA12
  Top 0.254: START.DATA7 65.49,19.48 v65.49,21.23
  Top 0.305: U1.14 65.09,34.23 v63.99,34.23
  Bottom 0.305: v65.49,21.23 65.49,31.88 63.99,33.38 v63.99,34.23
IO13  (via drill 0.35)
  Top 0.152: U1.16 69.83,33.05 69.83,32.55 69.05,31.77 68,31.77 v64.28,28.05
  Bottom 0.305: v64.28,28.05 64.28,26.37 Z.2
IO14  (via drill 0.35)
  Top 0.152: v66.75,35.76 v66.74,35.75 U1.13 | D_DOWN.DATA 14.25,10.85 D_DOWN.DATA2 D_DOWN.DATA3 D_DOWN.DATA4 D_DOWN.DATA5 D_DOWN.DATA6 D_DOWN.DATA7 D_DOWN.DATA8 D_DOWN.DATA9 D_DOWN.DATA10 | D_DOWN.DATA10 20.26,10.98 | D_DOWN.DATA12 D_DOWN.DATA11 D_DOWN.DATA10
  Top 0.305: 20.26,10.98 v22.99,10.98
  Bottom 0.152: v66.75,35.76 64.66,35.76 60.24,31.34 45.27,31.34 31.7,17.77 31.08,17.77 24.29,10.98 v22.99,10.98
IO15  (via drill 0.35)
  Top 0.203: U1.23 77.94,32.64 77.94,32.39 77.02,31.46 69.18,31.46 65.23,27.52 54.78,27.52 54.12,28.18 54.12,30.01 43.74,40.39 v43.74,44.66 v43.73,44.66 | v41.15,51.94 41.15,60.5 43.1,62.45 43.54,62.72 48.27,64.12 49.05,64.12 49.05,63.63 R10.2
  Bottom 0.203: v43.73,44.66 43.73,47.62 44.02,47.91 44.02,49.07 v41.15,51.94
IO16  (via drill 0.35)
  Top 0.152: v82.99,27.28 81.42,28.85 81.42,36.28 82.16,37.02 U1.27 | B.DATA 100.87,17.92 B.DATA2 B.DATA3 B.DATA4 B.DATA5 B.DATA6 B.DATA7 B.DATA8 B.DATA9 B.DATA10 B.DATA11 94.84,17.72 B.DATA12
  Top 0.254: 94.84,17.72 93.45,17.72 v92.84,18.33
  Bottom 0.152: v92.84,18.33 87.65,23.52 82.78,23.52 81.78,24.52 81.78,26.44 82.62,27.28 v82.99,27.28
IO17  (via drill 0.35)
  Top 0.152: U1.28 82.66,38.47 82.36,38.47 81.12,37.23 81.12,28.3 v82.99,26.43 | v115.04,16.33 116.04,15.33 117.47,15.33 C_DOWN.DATA 117.43,14.75 C_DOWN.DATA2 C_DOWN.DATA3 C_DOWN.DATA4 C_DOWN.DATA5 C_DOWN.DATA6 C_DOWN.DATA7 C_DOWN.DATA8 C_DOWN.DATA9 C_DOWN.DATA10 C_DOWN.DATA11 C_DOWN.DATA12
  Bottom 0.152: v115.04,16.33 110.04,21.33 104.23,21.33 101.56,24 82.95,24 82.38,24.57 82.38,25.89 82.92,26.43 v82.99,26.43
IO18  (via drill 0.35)
  Top 0.152: v82.99,24.83 80.54,27.28 80.54,38.92 82.45,40.83 U1.30 | C_RIGHT.DATA 127.57,25.55 | 127.57,25.55 124.66,25.55 v124.24,25.13 | C_RIGHT.DATA12 C_RIGHT.DATA11 C_RIGHT.DATA10 C_RIGHT.DATA9 C_RIGHT.DATA8 C_RIGHT.DATA7 C_RIGHT.DATA6 C_RIGHT.DATA5 C_RIGHT.DATA4 C_RIGHT.DATA3 C_RIGHT.DATA2 127.56,24.86 127.57,25.55
  Bottom 0.152: v82.99,24.83 83.06,24.76 102.32,24.67 104.85,22.14 120,22.14 123.09,25.23 124.14,25.23 v124.24,25.13
IO19
  Top 0.152: C_UP.DATA12 C_UP.DATA11 C_UP.DATA10 C_UP.DATA9 C_UP.DATA8 C_UP.DATA7 C_UP.DATA6 C_UP.DATA5 C_UP.DATA4 C_UP.DATA3 C_UP.DATA2 117.45,34.86 C_UP.DATA 117.37,35.96
  Top 0.254: U1.31 84.29,42.1 84.89,41.5 100.4,41.5 107.68,34.22 108,34.22 109.74,35.96 117.37,35.96
IO21  (via drill 0.35)
  Top 0.203: U1.33 83.43,45.23 83.69,45.23 84.48,46.03 v84.48,46.36
  Bottom 0.203: v84.48,46.36 88.83,46.36 88.97,46.5 98.37,46.5 104.46,40.41 108.22,40.41 108.64,40 108.64,38.37 107.69,37.42 RIGHT_S.2
IO22  (via drill 0.35)
  Top 0.152: U1.36 81.51,48.45 v81.49,48.43
  Top 0.203: 64.78,51.8 64.4,51.95 64.11,52.24 64.08,52.31 64.01,52.37 | 64.01,52.37 | 64.01,52.37 63.93,52.56 63.92,52.64 63.91,52.65 63.91,52.79 63.6,57.78 v61.83,57.78 | v77.73,50.93 76.86,51.8 64.78,51.8 | 64.78,51.8 | R20.1 50.14,62.5 50.15,62.51 50.4,62.26 50.4,58.86 v50.6,58.66
  Bottom 0.203: v81.49,48.43 78.99,50.93 v77.73,50.93 | v61.83,57.78 55.86,57.78 55.84,57.8 51.46,57.8 v50.6,58.66
IO23  (via drill 0.35)
  Top 0.203: v50.6,57.39 49.65,58.34 49.65,61.43 R1.2
  Top 0.305: U1.37 74.5,49.72 v73.79,50.43
  Bottom 0.305: v73.79,50.43 72.51,51.72 61.39,51.72 55.68,57.42 50.63,57.42 v50.6,57.39
IO25  (via drill 0.35)
  Top 0.152: v67,39.23 65.67,39.23 U1.10 | D_UP.DATA 14.26,30.21 D_UP.DATA2 D_UP.DATA3 D_UP.DATA4 D_UP.DATA5 D_UP.DATA6 D_UP.DATA7 D_UP.DATA8 D_UP.DATA9 D_UP.DATA10 D_UP.DATA11 | D_UP.DATA11 D_UP.DATA12 | D_UP.DATA11 20.36,30.48
  Top 0.305: 20.36,30.48 v22.99,30.48
  Bottom 0.152: v22.99,30.48 22.99,31.13 31.08,39.22 36.06,39.22 43.06,32.22 59.69,32.22 66.71,39.23 v67,39.23
IO26  (via drill 0.35)
  Top 0.152: U1.11 65.4,38.35 v66.87,38.35 | D_LEFT.DATA 4.95,20.29 D_LEFT.DATA2 D_LEFT.DATA3 D_LEFT.DATA4 D_LEFT.DATA5 D_LEFT.DATA6 D_LEFT.DATA7 D_LEFT.DATA8 D_LEFT.DATA9 | D_LEFT.DATA12 D_LEFT.DATA11 D_LEFT.DATA10
  Top 0.2: D_LEFT.DATA9 D_LEFT.DATA10
  Top 0.254: D_LEFT.DATA11 13.91,20.4 v13.93,20.38
  Bottom 0.152: v66.87,38.35 v66.86,38.36 66.34,38.36 59.89,31.92 29.88,31.92 19.6,21.64 15.3,21.64 14.04,20.38 v13.93,20.38
IO27  (via drill 0.35)
  Top 0.152: v66.8,37.03 v66.79,37.02 U1.12 | D_RIGHT.DATA 24.17,20.23 D_RIGHT.DATA2 D_RIGHT.DATA3 D_RIGHT.DATA4 D_RIGHT.DATA5 D_RIGHT.DATA6 D_RIGHT.DATA7 D_RIGHT.DATA8 D_RIGHT.DATA9 D_RIGHT.DATA10 D_RIGHT.DATA11
  Top 0.2: D_RIGHT.DATA12 D_RIGHT.DATA11 v32.94,20.73
  Bottom 0.152: v32.94,20.73 34.14,20.73 45.03,31.62 60.04,31.62 65.46,37.03 v66.8,37.03
IO32
  Top 0.305: R23.1 65.31,42.13 U1.8
IO33  (via drill 0.35)
  Top 0.305: v67.11,40.12 67.11,40.41 66.69,40.83 U1.9
  Bottom 0.152: 35.47,40.21 43.16,32.52 59.51,32.52 v67.11,40.12
  Bottom 0.254: 35.47,40.21 26.32,40.21 LEFT_S.2
IO34  (via drill 0.35)
  Top 0.305: C5.1 63.23,40.08 v63.99,40.08 | v67.81,44.88 65.58,44.88 U1.6
  Bottom 0.2: JOYSTICK.4 68.59,27.18 68.59,43.45 67.93,44.11 67.81,44.11
  Bottom 0.305: v63.99,40.08 64.05,40.08 67.81,43.84 67.81,44.11 v67.81,44.88
IO35  (via drill 0.35)
  Top 0.254: 66.22,43.53 65.5,43.53 U1.7
  Top 0.305: C9.1 63.44,38.57 63.89,39.03 v63.99,39.03 | v67,41.97 67,42.75 66.22,43.53
  Bottom 0.2: 78.96,14.91 72.31,21.43 72.31,22.37 67.99,26.69 67.99,40.98 67.06,41.91
  Bottom 0.254: 78.96,14.91 83.64,14.91 83.64,16.13 JOYSTICK.2
  Bottom 0.305: v63.99,39.03 64.14,39.18 65.08,39.18 67.06,41.16 67.06,41.91 v67,41.97
IO36
  Top 0.305: R17.1 62.87,44.59 R18.2 62.84,45.35 64.62,47.14 65.3,47.14 U1.4
N$1
  Top 0.203: R20.2 47.12,61.02 47.12,59.85 46.65,59.38 43.89,59.38 43.08,60.19 U$1.VR
N$2  (via drill 0.35)
  Top 0.152: U4.3 57.4,50.03 v57.08,49.71
  Top 0.305: v61.29,46.93 61.26,46.9 R16.1
  Bottom 0.152: v57.08,49.71 57.08,49.03 58.08,48.03
  Bottom 0.305: v61.29,46.93 v61.28,46.93 60.67,46.32 58.2,46.32 57.86,46.66 57.86,47.8 58.08,48.03 58.35,48.3 AP2112.3
N$4
  Top 0.305: R23.2 61.83,42.11 61.83,41.09 R22.1 60.09,42.81 56.1,42.81 55.93,42.97 55.93,43.32 T8.1 53.42,44.54 53.2,44.76 52.6,44.76 D9.A
N$5
  Top 0.203: R10.1 46.31,61.43 U$1.VG
N$6
  Top 0.127: R4.2 88.26,38.44 T1.1
N$7
  Top 0.127: T2.1 89.04,33.88 R7.2
N$8  (via drill 0.35)
  Top 0.254: v32.79,44.83 33.22,45.26 U3.8 | v39.09,42.93 39.09,41.5 U3.4
  Top 0.305: R13.1 R14.1
  Top 0.406: R13.1 | U3.8 34.09,45.99 36.25,48.16 R11.1 R12.1 R13.1 | R13.1 R14.1 41.68,48.41 C13.1 41.68,48.92 R13.1
  Bottom 0.254: v39.09,42.93 34.69,42.93 v32.79,44.83
N$9
  Top 0.203: R1.1 47.95,60.62 U$1.VB
N$11
  Top 0.127: U2.9 92.71,27.52 92.71,27.15 92.21,26.65 R2.2
N$14
  Top 0.127: R3.1 91.14,26.14 R6.2 91.16,26.48 U2.8
N$15  (via drill 0.35)
  Top 0.305: R21.2 59.73,43.85 58.75,43.85 C6.2 57.13,43.8 T8.3 55.89,44.61 55.89,47.23 54.83,48.3 T6.1 54.83,49.46 v55.16,49.79 | D10.A 50.83,44.78 52.39,46.34 52.39,46.99 v52.6,47.2
  Bottom 0.305: v55.16,49.79 v55.16,49.78 52.6,47.22 v52.6,47.2
N$17  (via drill 0.35)
  Top 0.127: v35.97,35.3 35.58,35.69 35.58,37.08 | 35.44,40.22 35.39,40.13 35.42,40.09 35.42,39.8 35.42,38.47 R9.2
  Top 0.152: 35.58,37.08 35.56,37.08 34.46,38.18 35.42,39.8
  Top 0.406: 35.44,40.22 U3.2
N$23
  Top 0.127: R5.1 93.84,27.65 U2.11
N$28  (via drill 0.35)
  Top 0.305: CTRL.1 CTRL.2 | D10.C D9.C 53.13,42.63 55.3,40.46 v59.96,40.46 v59.96,40.45 | v66.84,44.1 68.43,44.1 72.22,47.88 v73.24,47.88
  Bottom 0.305: v59.96,40.45 60.15,40.45 63.8,44.1 v66.84,44.1 | CTRL.1 88.71,53.49 86.87,51.64 77,51.64 v73.24,47.88
RTS
  Top 0.127: R7.1 90.21,35.36 90.21,39.11 T1.2
  Top 0.152: U2.24 94.49,32.52 94.49,34.59 93.94,35.14 90.94,35.14 R7.1
RXD0  (via drill 0.35)
  Top 0.152: U1.34 81.46,45.91 v81.39,45.98
  Top 0.2: v93.08,34.34 U2.26
  Bottom 0.152: v81.39,45.98 81.62,45.75 88.66,45.75 89.1,46.19 92.4,46.19 UART.3 95.01,43.58 95.01,37.89 93.08,35.97 v93.08,34.34
TXD0  (via drill 0.35)
  Top 0.152: U1.35 83.1,47.18 83.28,47 84.83,47 86.34,45.49 v86.34,45.07
  Top 0.2: v93.95,33.52 U2.25
  Bottom 0.152: v93.95,33.52 93.08,33.52 90.21,36.39 90.21,40.94 92.42,43.15 UART.2 92.42,45.64 92.18,45.87 89.33,45.87 88.52,45.06 v86.35,45.06 v86.34,45.07
USB_DN  (via drill 0.35)
  Top 0.152: J1.P$2 J1.B7 | J1.P$1 55.87,59.18 J1.A7
  Top 0.305: v44.34,42.77 44.55,42.56 44.55,41.9 44.86,41.59 D4.2 52.67,33.5 66.06,33.5 69.59,37.03 v69.59,38.67 | U2.5 85.36,29.56 v84.44,30.48
  Top 0.406: v53.38,54.55 53.38,55.64 56.39,58.65 56.39,59.26 J1.P$1
  Bottom 0.152: J1.P$1 56.21,60.05 J1.P$2
  Bottom 0.305: v84.44,30.48 77.78,30.48 v69.59,38.67
  Bottom 0.406: v53.38,54.55 53.38,50.37 46.01,43 44.57,43 v44.34,42.77
USB_DP  (via drill 0.35)
  Top 0.152: J1.B6 55.96,60.43 56.18,60.24 56.25,59.92 56.73,59.92 J1.A6 56.88,59.87 56.88,59.56
  Top 0.305: D5.2 42.27,34.44 42.27,34.69 v42.23,34.66 | U2.4 85.76,30.06 v84.49,31.33 | v54.39,53.79 54.2,53.98 54.2,55.33 57.27,58.4 57.27,59.16 56.88,59.56
  Bottom 0.2: v84.49,31.33 79.98,31.33 69.14,42.17 69.14,44.88 68.17,45.86
  Bottom 0.305: 68.17,45.86 54.73,45.86
  Bottom 0.406: v42.23,34.66 42.23,34.77 47.08,39.62 47.08,40.64 54.73,48.29 54.73,48.28 | v54.39,53.79 56.16,52.03 56.16,49.71 54.73,48.28 | 54.73,45.86 54.73,48.28
VBAT  (via drill 0.35)
  Top 0.305: R17.2 60.78,44.24 v60.7,44.24
  Top 0.406: J2.1 43.48,56.56 43.59,56.56 48.7,56.56 T3.3 50.24,56.7 51.81,55.13 v51.81,54.91 | v49.51,40.91 46.14,44.28 v46.14,45.48 38.12,45.48 U3.5
  Bottom 0.305: v60.7,44.24 52.84,44.24 v49.51,40.91
  Bottom 0.406: v46.14,45.48 46.93,46.27 48.27,46.27 51.83,49.83 51.83,54.91 v51.81,54.91
VBUS  (via drill 0.35)
  Top 0.152: J1.A4 57.38,61.17 57.32,61.34 J1.B9 57.18,61.98 54.76,61.57 J1.B4 54.94,60.41 54.7,60.2 J1.A9 54.88,59.29
  Top 0.305: v44.15,38.8 44.15,37.46 D3.2 51.57,29.7 51.57,27.88 53.1,26.34 65.85,26.34 73.86,18.33 89.91,18.33 90.09,18.52 90.09,25.13 R3.2
  Top 0.406: v55.1,50.86 55.1,51.55 54.04,52.61 D2.A 52.55,53.99 52.55,56.01 54.88,58.34 54.88,59.29
  Bottom 0.406: v44.15,38.8 44.15,39.99 55.02,50.86 v55.1,50.86
VCC  (via drill 0.35)
  Top 0.305: R21.1 59.75,45.13 58.73,45.13 C6.1 58.69,45.12 v57.52,45.12
  Top 0.406: T3.2 50.17,54.5 53.96,50.71 D6.C 53.8,50.4 53.8,47.27 54.49,46.58 T6.2 54.74,46.58 54.72,46.6 54.01,46.6 v53.33,45.92
  Bottom 0.305: v53.33,45.92 54.14,45.11 v57.51,45.11 v57.52,45.12
VDD  (via drill 0.35)
  Top 0.305: T6.3 57.83,47.53 v58.46,46.9 R16.2
  Top 0.406: v58.46,46.9 58.27,47.09 C14.1 | U4.1 55.5,52.49 55.75,52.25 55.75,50.65 56.01,50.39 56.01,48.55 T6.3
  Bottom 0.305: AP2112.1 60.81,47.77 60.81,47.65 60.06,46.9 v58.46,46.9
VDD33  (via drill 0.35)
  Top 0.127: C3.2 C4.2 | C3.2 89.44,27.33 90.29,27.33 | 91.47,28.5 U2.7 | R2.1 91.7,25.63 90.74,25.63 90.71,25.65 89.68,25.65 89.57,25.76 89.57,27.12 C3.2
  Top 0.254: 88.05,24.9 89.61,23.34 87.85,21.58 v86.64,21.58
  Top 0.305: C16.1 61.26,53.55 61.26,53.57 | C15.1 61.44,53.4 61.44,53.39 | U1.2 62.65,49.72 v62.44,49.93 63.34,49.03 R8.2 | C4.2 85.73,27.34 v85.04,28.03 | C4.2 89.43,27.34 89.44,27.33 | C3.2 90.29,27.33 91.47,28.5 | U2.7 U2.6 | C4.2 88.05,24.9
  Top 0.406: v62.44,49.93 62.44,52.4 61.44,53.4 | 61.44,53.39 61.26,53.57 | U4.5 55.73,55.34 v56.54,55.34
  Bottom 0.152: 85.07,35.11 89.88,39.91 UART.1
  Bottom 0.254: v86.64,21.58 86.64,17.43 JOYSTICK.1
  Bottom 0.305: AP2112.5 60.36,50.89 61.46,50.91 v62.44,49.93 70.2,49.93 85.07,35.06 | v85.04,28.03 85.07,28.07 85.07,35.06 | 85.07,35.11 85.07,35.06
  Bottom 0.406: v56.54,55.34 58.44,53.44 58.6,53.44 60.36,51.68 60.36,50.89

## Text on the board
tPlace: JLCJLCJLCJLC
Document: HOLE | HOLE | HOLE
tDocu: HOLE | HOLE | HOLE | HOLE | HOLE | HOLE | HOLE | HOLE | HOLE | HOLE